# Altium project NFC-Reader.PrjPcb (part 9 of 11)
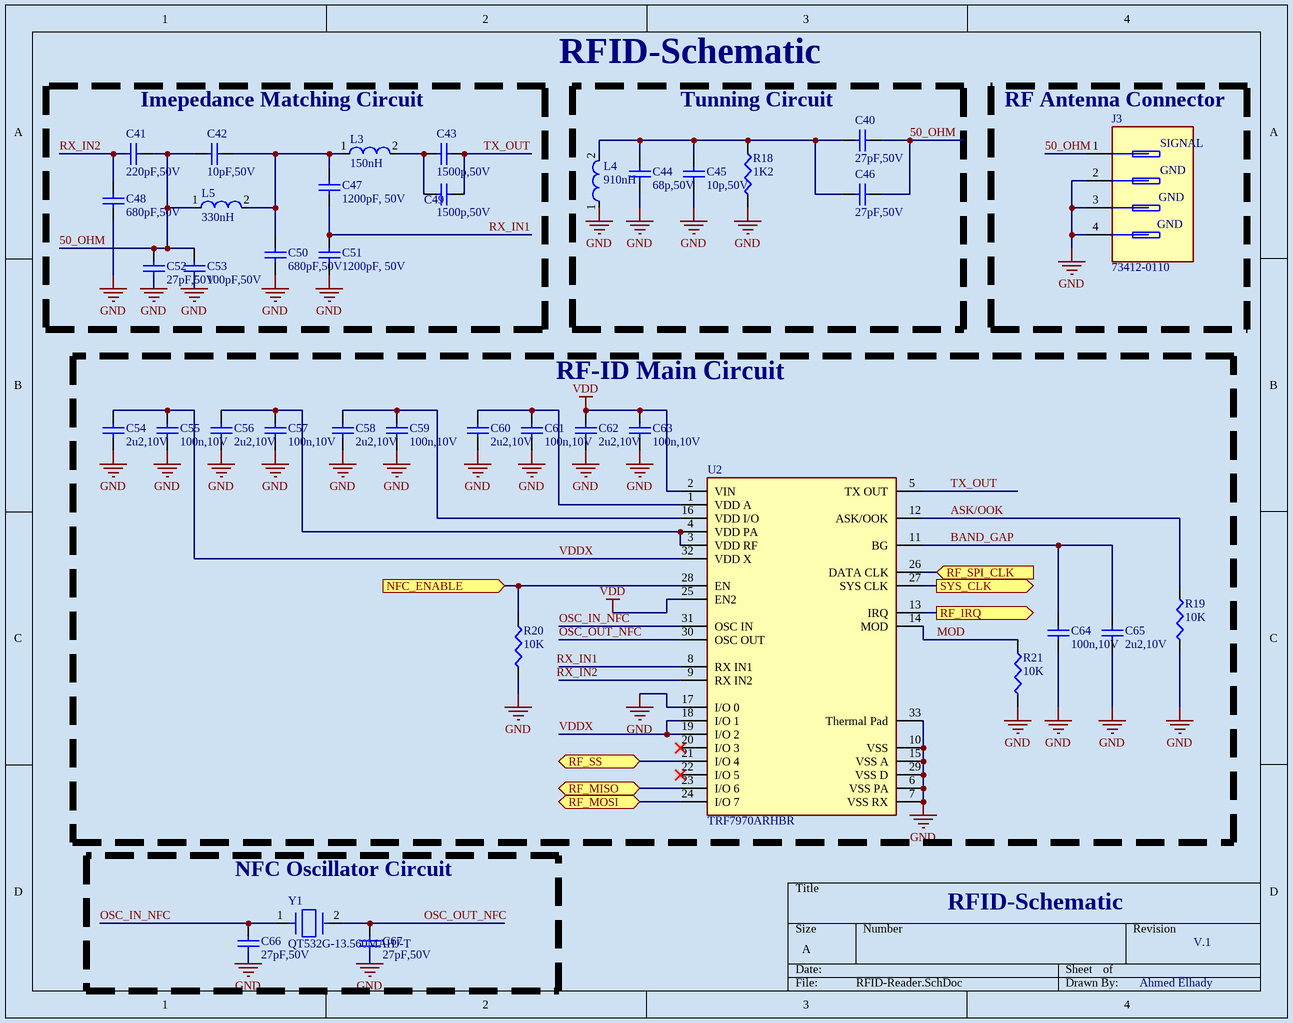
[diagram p12: RFID-Reader.SchDoc]

## Sheet RFID-Reader.SchDoc (continued)

### Library data of the parts (continued)
C53 = GRM1555C1H101JA01D: 100 pF ±5% 50V Ceramic Capacitor C0G, NP0 0402 (1005 Metric); Manufacturer: Murata; Manufacturer Lifecycle Status: NRND; Supplier: DigiKey; Manufacturer Part Number: GRM1555C1H101JA01D; RoHS: Compliant; Category: Ceramic Capacitors; Stock: 456624; Pricing: 1=0.1, 10=0.022, 50=0.0144, 100=0.0122, 500=0.0085, 1000=0.00738, 2500=0.0062, 5000=0.0055 (USD); Value: 100pF; Case/Package: 0402; Case Code (Imperial): 0402; Case Code (Metric): 1005; Depth: 500µm; Dielectric: C0G; Dielectric Material: Ceramic; Height: 500µm; Lead Free: Lead Free; Length: 1mm; Lifecycle Status: NRND; Material: Ceramic; Max Operating Temperature: 125°C; Min Operating Temperature: -55°C; Mounting Technology: Surface Mount; Number of Terminals: 2; Packaging: Cut Tape; Radiation Hardening: No; REACH SVHC: Yes; Schedule B: 8532240020, 8532240020|8532240020, 8532240020|8532240020|8532240020, 8532240020|8532240020|8532240020|8532240020; Termination: SMD/SMT; Thickness: 500µm; Tolerance: 5%; Voltage: 50V; Voltage Rating: 50V; Voltage Rating (DC): 50V; Width: 500µm; ComponentLink1URL: https://datasheet.octopart.com:443/GRM1555C1H101JA01D-Murata-datasheet-12559435.pdf?src-supplier=element14+APAC; ComponentLink1Description: https://datasheet.octopart.com:443/GRM1555C1H101JA01D-Murata-datasheet-12559435.pdf?src-supplier=element14+APAC; ComponentLink2URL: https://datasheet.octopart.com:443/GRM1555C1H101JA01D-Murata-datasheet-62317043.pdf?src-supplier=element14+APAC; ComponentLink2Description: https://datasheet.octopart.com:443/GRM1555C1H101JA01D-Murata-datasheet-62317043.pdf?src-supplier=element14+APAC; ComponentLink3URL: https://datasheet.octopart.com:443/GRM1555C1H101JA01D-Murata-datasheet-11894428.pdf?src-supplier=_legacy+Avnet; ComponentLink3Description: https://datasheet.octopart.com:443/GRM1555C1H101JA01D-Murata-datasheet-11894428.pdf?src-supplier=_legacy+Avnet; ComponentLink4URL: https://datasheet.octopart.com:443/GRM1555C1H101JA01D-Murata-datasheet-14396361.pdf?src-supplier=Future+Electronics; ComponentLink4Description: https://datasheet.octopart.com:443/GRM1555C1H101JA01D-Murata-datasheet-14396361.pdf?src-supplier=Future+Electronics; ComponentLink5URL: https://datasheet.octopart.com:443/GRM1555C1H101JA01D-Murata-datasheet-22122223.pdf?src-supplier=Future+Electronics; ComponentLink5Description: https://datasheet.octopart.com:443/GRM1555C1H101JA01D-Murata-datasheet-22122223.pdf?src-supplier=Future+Electronics; ComponentLink6URL: https://datasheet.octopart.com:443/GRM1555C1H101JA01D-Murata-datasheet-44105804.pdf?src-supplier=Future+Electronics; ComponentLink6Description: https://datasheet.octopart.com:443/GRM1555C1H101JA01D-Murata-datasheet-44105804.pdf?src-supplier=Future+Electronics; ComponentLink7URL: https://datasheet.octopart.com:443/GRM1555C1H101JA01D-Murata-datasheet-165579666.pdf?src-supplier=TME; ComponentLink7Description: https://datasheet.octopart.com:443/GRM1555C1H101JA01D-Murata-datasheet-165579666.pdf?src-supplier=TME; ComponentLink8URL: https://datasheet.octopart.com:443/GRM1555C1H101JA01D-Murata-datasheet-59876780.pdf?src-supplier=TME; ComponentLink8Description: https://datasheet.octopart.com:443/GRM1555C1H101JA01D-Murata-datasheet-59876780.pdf?src-supplier=TME; ComponentLink9URL: https://datasheet.octopart.com:443/GRM1555C1H101JA01D-Murata-datasheet-141266224.pdf?src-supplier=Ciiva; ComponentLink9Description: https://datasheet.octopart.com:443/GRM1555C1H101JA01D-Murata-datasheet-141266224.pdf?src-supplier=Ciiva; ComponentLink10URL: https://datasheet.octopart.com:443/GRM1555C1H101JA01D-Murata-datasheet-140680898.pdf?src-supplier=Ciiva; ComponentLink10Description: https://datasheet.octopart.com:443/GRM1555C1H101JA01D-Murata-datasheet-140680898.pdf?src-supplier=Ciiva; ComponentLink11URL: https://datasheet.octopart.com:443/GRM1555C1H101JA01D-Murata-datasheet-138739442.pdf?src-supplier=Ciiva; ComponentLink11Description: https://datasheet.octopart.com:443/GRM1555C1H101JA01D-Murata-datasheet-138739442.pdf?src-supplier=Ciiva; ComponentLink12URL: https://datasheet.octopart.com/GRM1555C1H101JA01D-Murata-datasheet-12515295.pdf; ComponentLink12Description: https://datasheet.octopart.com/GRM1555C1H101JA01D-Murata-datasheet-12515295.pdf; ComponentLink13URL: https://datasheet.octopart.com/GRM1555C1H101JA01D-Murata-datasheet-12510076.pdf; ComponentLink13Description: https://datasheet.octopart.com/GRM1555C1H101JA01D-Murata-datasheet-12510076.pdf; ComponentLink14URL: https://datasheet.octopart.com/GRM1555C1H101JA01D-Murata-datasheet-11978611.pdf; ComponentLink14Description: https://datasheet.octopart.com/GRM1555C1H101JA01D-Murata-datasheet-11978611.pdf; ComponentLink15URL: https://datasheet.octopart.com/GRM1555C1H101JA01D-Murata-datasheet-10025737.pdf; ComponentLink15Description: https://datasheet.octopart.com/GRM1555C1H101JA01D-Murata-datasheet-10025737.pdf; ComponentLink16URL: https://datasheet.octopart.com/GRM1555C1H101JA01D-Murata-datasheet-8819587.pdf; ComponentLink16Description: https://datasheet.octopart.com/GRM1555C1H101JA01D-Murata-datasheet-8819587.pdf; ComponentLink17URL: http://sigma.octopart.com:80/reach_statement/Murata-company-16.pdf?src-supplier=Compliance+Statements; ComponentLink17Description: http://sigma.octopart.com:80/reach_statement/Murata-company-16.pdf?src-supplier=Compliance+Statements; LCSC PN: C77177
C54 C56 C58 C60 C62 C65 = GRM155Z71A225KE44D: 2.2 µF ±10% 10V Ceramic Capacitor X7R 0402 (1005 Metric); Manufacturer: Murata; Manufacturer Lifecycle Status: IN PRODUCTION; Value: 2.2µF; Supplier: DigiKey; Manufacturer Part Number: GRM155Z71A225KE44D; RoHS: Compliant; Category: Ceramic Capacitors; Stock: 150874; Pricing: 1=0.15, 10=0.083, 50=0.0582, 100=0.0506, 500=0.0359, 1000=0.03409, 2500=0.02999 (USD); Case/Package: 0402; Dielectric Material: Ceramic; Height: 500µm; Length: 1mm; Lifecycle Status: Production; Material: Ceramic; Max Operating Temperature: 125°C; Min Operating Temperature: -55°C; Mounting Technology: Surface Mount; Pins: 2; Number of Terminals: 2; REACH SVHC: Yes; Thickness: 500µm; Tolerance: 10%; Voltage Rating: 10V; Voltage Rating (DC): 10V; Width: 500µm; ComponentLink1URL: https://datasheet.octopart.com:443/GRM155Z71A225KE44D-Murata-datasheet-165579666.pdf?src-supplier=TME; ComponentLink1Description: https://datasheet.octopart.com:443/GRM155Z71A225KE44D-Murata-datasheet-165579666.pdf?src-supplier=TME; ComponentLink2URL: https://datasheet.octopart.com:443/GRM155Z71A225KE44D-Murata-datasheet-141266224.pdf?src-supplier=Ciiva; ComponentLink2Description: https://datasheet.octopart.com:443/GRM155Z71A225KE44D-Murata-datasheet-141266224.pdf?src-supplier=Ciiva; ComponentLink3URL: https://datasheet.octopart.com:443/GRM155Z71A225KE44D-Murata-datasheet-140692717.pdf?src-supplier=Ciiva; ComponentLink3Description: https://datasheet.octopart.com:443/GRM155Z71A225KE44D-Murata-datasheet-140692717.pdf?src-supplier=Ciiva; ComponentLink4URL: https://datasheet.octopart.com:443/GRM155Z71A225KE44D-Murata-datasheet-138741105.pdf?src-supplier=Ciiva; ComponentLink4Description: https://datasheet.octopart.com:443/GRM155Z71A225KE44D-Murata-datasheet-138741105.pdf?src-supplier=Ciiva; ComponentLink5URL: http://sigma.octopart.com:80/reach_statement/Murata-company-16.pdf?src-supplier=Compliance+Statements; ComponentLink5Description: http://sigma.octopart.com:80/reach_statement/Murata-company-16.pdf?src-supplier=Compliance+Statements; LCSC PN: C2999759
C55 C57 C59 C61 C63 C64 = CL05B104KP5NNNC: 0.1 µF ±10% 10V Ceramic Capacitor X7R 0402 (1005 Metric); Manufacturer: Samsung Electro-Mechanics; Value: 100nF; Supplier: DigiKey; Manufacturer Part Number: CL05B104KP5NNNC; RoHS: Compliant; Category: Ceramic Capacitors; Stock: 28864890; Pricing: 1=0.1, 10=0.023, 50=0.0152, 100=0.0129, 500=0.00904, 1000=0.00787, 2500=0.00663, 5000=0.00589 (USD); Case/Package: 0402; Case Code (Imperial): 0402; Case Code (Metric): 1005; China RoHS: Compliant; Contact Plating: Tin; Depth: 500µm; Dielectric: X7R; Dielectric Material: Ceramic; Height: 500µm; Length: 1mm; Lifecycle Status: Production; Material: Ceramic; Max Operating Temperature: 125°C; Min Operating Temperature: -55°C; Mounting Technology: Surface Mount; Number of Terminals: 2; Radiation Hardening: No; REACH SVHC: Yes; Schedule B: 8532240020, 8532240020|8532240020, 8532240020|8532240020|8532240020, 8532240020|8532240020|8532240020|8532240020; Thickness: 558.8µm; Tolerance: 10%; Voltage Rating: 10V; Voltage Rating (DC): 10V; Width: 500µm; ComponentLink1URL: https://datasheet.octopart.com:443/CL05B104KP5NNNC-Samsung-Electro-Mechanics-datasheet-182018737.pdf?src-supplier=IHS; ComponentLink1Description: https://datasheet.octopart.com:443/CL05B104KP5NNNC-Samsung-Electro-Mechanics-datasheet-182018737.pdf?src-supplier=IHS; ComponentLink2URL: https://datasheet.octopart.com/CL05B104KP5NNNC-Samsung-Electro-Mechanics-datasheet-8324245.pdf; ComponentLink2Description: https://datasheet.octopart.com/CL05B104KP5NNNC-Samsung-Electro-Mechanics-datasheet-8324245.pdf; ComponentLink3URL: https://datasheet.octopart.com/CL05B104KP5NNNC-Samsung-Electro-Mechanics-datasheet-97040617.pdf; ComponentLink3Description: https://datasheet.octopart.com/CL05B104KP5NNNC-Samsung-Electro-Mechanics-datasheet-97040617.pdf; ComponentLink4URL: https://datasheet.octopart.com/General-Multilayer-Ceramic-Capacitors-Samsung-datasheet-family-111.pdf; ComponentLink4Description: https://datasheet.octopart.com/General-Multilayer-Ceramic-Capacitors-Samsung-datasheet-family-111.pdf; ComponentLink5URL: https://datasheet.octopart.com:443/CL05B104KP5NNNC-Samsung-Electro-Mechanics-datasheet-141346865.pdf?src-supplier=Samsung+SCT; ComponentLink5Description: https://datasheet.octopart.com:443/CL05B104KP5NNNC-Samsung-Electro-Mechanics-datasheet-141346865.pdf?src-supplier=Samsung+SCT; ComponentLink6URL: https://datasheet.octopart.com:443/CL05B104KP5NNNC-Samsung-Electro-Mechanics-datasheet-116890912.pdf?src-supplier=Future+Electronics; ComponentLink6Description: https://datasheet.octopart.com:443/CL05B104KP5NNNC-Samsung-Electro-Mechanics-datasheet-116890912.pdf?src-supplier=Future+Electronics; ComponentLink7URL: https://datasheet.octopart.com:443/CL05B104KP5NNNC-Samsung-Electro-Mechanics-datasheet-81461625.pdf?src-supplier=Future+Electronics; ComponentLink7Description: https://datasheet.octopart.com:443/CL05B104KP5NNNC-Samsung-Electro-Mechanics-datasheet-81461625.pdf?src-supplier=Future+Electronics; ComponentLink8URL: https://datasheet.octopart.com:443/CL05B104KP5NNNC-Samsung-datasheet-42485124.pdf?src-supplier=Future+Electronics; ComponentLink8Description: https://datasheet.octopart.com:443/CL05B104KP5NNNC-Samsung-datasheet-42485124.pdf?src-supplier=Future+Electronics; ComponentLink9URL: https://datasheet.octopart.com:443/CL05B104KP5NNNC-Samsung-datasheet-26589026.pdf?src-supplier=Future+Electronics; ComponentLink9Description: https://datasheet.octopart.com:443/CL05B104KP5NNNC-Samsung-datasheet-26589026.pdf?src-supplier=Future+Electronics; ComponentLink10URL: https://datasheet.octopart.com:443/CL05B104KP5NNNC-Samsung-Electro-Mechanics-datasheet-149136717.pdf?src-supplier=Future+Electronics; ComponentLink10Description: https://datasheet.octopart.com:443/CL05B104KP5NNNC-Samsung-Electro-Mechanics-datasheet-149136717.pdf?src-supplier=Future+Electronics; ComponentLink11URL: https://datasheet.octopart.com:443/CL05B104KP5NNNC-Samsung-Electro-Mechanics-datasheet-17925223.pdf?src-supplier=iiiC; ComponentLink11Description: https://datasheet.octopart.com:443/CL05B104KP5NNNC-Samsung-Electro-Mechanics-datasheet-17925223.pdf?src-supplier=iiiC; ComponentLink12URL: https://datasheet.octopart.com:443/CL05B104KP5NNNC-Samsung-datasheet-8326407.pdf?src-supplier=TME; ComponentLink12Description: https://datasheet.octopart.com:443/CL05B104KP5NNNC-Samsung-datasheet-8326407.pdf?src-supplier=TME; ComponentLink13URL: http://sigma.octopart.com:80/rohs_certificate/General-Multilayer-Ceramic-Capacitors-Samsung-family-110.pdf?src-supplier=Compliance+Statements; ComponentLink13Description: http://sigma.octopart.com:80/rohs_certificate/General-Multilayer-Ceramic-Capacitors-Samsung-family-110.pdf?src-supplier=Compliance+Statements; ComponentLink14URL: http://sigma.octopart.com:80/rohs_statement/General-Multilayer-Ceramic-Capacitors-Samsung-family-132.pdf?src-supplier=Compliance+Statements; ComponentLink14Description: http://sigma.octopart.com:80/rohs_statement/General-Multilayer-Ceramic-Capacitors-Samsung-family-132.pdf?src-supplier=Compliance+Statements; ComponentLink15URL: http://sigma.octopart.com:80/reach_statement/General-Multilayer-Ceramic-Capacitors-Samsung-family-133.pdf?src-supplier=Compliance+Statements; ComponentLink15Description: http://sigma.octopart.com:80/reach_statement/General-Multilayer-Ceramic-Capacitors-Samsung-family-133.pdf?src-supplier=Compliance+Statements; LCSC PN: C133086
J3 = 73412-0110: U.FL (UMCC) ANTENNA Connector Receptacle, Male Pin 50 Ohms Surface Mount Solder; Manufacturer: Molex; Manufacturer Lifecycle Status: ACTIVE; Body Material: Liquid Crystal Polymer, Polymer; Body Plating: Gold; Connector Type: Coaxial; Contact Resistance: 25mΩ; Dielectric Material: Liquid Crystal Polymer; Frequency: 6GHz; Gender: Female; Impedance: 50Ω; Insulation Resistance: 100MΩ; Number of Ports: 1; Polarity: Standard; Voltage Rating: 60V; Supplier: DigiKey; Manufacturer Part Number: 73412-0110; RoHS: Compliant; Category: RF / Coaxial Connectors; Stock: 130802; Pricing: 1=0.8, 10=0.675, 25=0.6328, 50=0.6028, 100=0.5739, 250=0.53788, 500=0.5122, 1000=0.48774, 2500=0.4572, 5000=0.42867, 10000=0.40822, 15000=0.39672, 25000=0.38269 (USD); China RoHS: Compliant; Contact Gender: Female; Contact Material: Brass; Contact Plating: Gold; Country of Origin: US; Halogen Free: Low Halogen; Height: 1.25mm; Lead Free: Lead Free; Length: 3mm; Lifecycle Status: Production; Material: Bronze; Clock Frequency: 6GHz; Max Operating Temperature: 90°C; Min Operating Temperature: -40°C; Mounting Technology: Surface Mount; Pins: 1; Orientation: Straight; Packaging: Tape and Reel; Radiation Hardening: No; REACH SVHC: Yes; Termination: Solder; Voltage Rating (AC): 60V; Width: 3mm; ComponentLink1URL: https://datasheet.octopart.com:443/73412-0110-Molex-datasheet-180780342.pdf?src-supplier=IHS; ComponentLink1Description: https://datasheet.octopart.com:443/73412-0110-Molex-datasheet-180780342.pdf?src-supplier=IHS; ComponentLink2URL: https://datasheet.octopart.com:443/73412-0110-Molex-datasheet-13797444.pdf?src-supplier=Molex; ComponentLink2Description: https://datasheet.octopart.com:443/73412-0110-Molex-datasheet-13797444.pdf?src-supplier=Molex; ComponentLink3URL: https://datasheet.octopart.com:443/73412-0110-Molex-datasheet-12565081.pdf?src-supplier=Upverter; ComponentLink3Description: https://datasheet.octopart.com:443/73412-0110-Molex-datasheet-12565081.pdf?src-supplier=Upverter; ComponentLink4URL: https://datasheet.octopart.com:443/73412-0110-Molex-datasheet-8545995.pdf?src-supplier=Upverter; ComponentLink4Description: https://datasheet.octopart.com:443/73412-0110-Molex-datasheet-8545995.pdf?src-supplier=Upverter; ComponentLink5URL: https://datasheet.octopart.com:443/73412-0110-Molex-datasheet-154758340.pdf?src-supplier=Master+Electronics; ComponentLink5Description: https://datasheet.octopart.com:443/73412-0110-Molex-datasheet-154758340.pdf?src-supplier=Master+Electronics; ComponentLink6URL: https://datasheet.octopart.com:443/73412-0110-Molex-datasheet-101583680.pdf?src-supplier=Farnell; ComponentLink6Description: https://datasheet.octopart.com:443/73412-0110-Molex-datasheet-101583680.pdf?src-supplier=Farnell; ComponentLink7URL: https://datasheet.octopart.com:443/73412-0110-Molex-datasheet-11536961.pdf?src-supplier=Farnell; ComponentLink7Description: https://datasheet.octopart.com:443/73412-0110-Molex-datasheet-11536961.pdf?src-supplier=Farnell; ComponentLink8URL: https://datasheet.octopart.com:443/73412-0110-Molex-datasheet-11046821.pdf?src-supplier=Farnell; ComponentLink8Description: https://datasheet.octopart.com:443/73412-0110-Molex-datasheet-11046821.pdf?src-supplier=Farnell; ComponentLink9URL: https://datasheet.octopart.com:443/73412-0110-Molex-datasheet-540048.pdf?src-supplier=Farnell; ComponentLink9Description: https://datasheet.octopart.com:443/73412-0110-Molex-datasheet-540048.pdf?src-supplier=Farnell; ComponentLink10URL: https://datasheet.octopart.com:443/73412-0110-Molex-datasheet-27085815.pdf?src-supplier=Electro+Sonic; ComponentLink10Description: https://datasheet.octopart.com:443/73412-0110-Molex-datasheet-27085815.pdf?src-supplier=Electro+Sonic; ComponentLink11URL: https://datasheet.octopart.com:443/73412-0110-Molex-datasheet-44403139.pdf?src-supplier=Electro+Sonic; ComponentLink11Description: https://datasheet.octopart.com:443/73412-0110-Molex-datasheet-44403139.pdf?src-supplier=Electro+Sonic; ComponentLink12URL: https://datasheet.octopart.com:443/73412-0110-Molex-datasheet-188909867.pdf?src-supplier=TME; ComponentLink12Description: https://datasheet.octopart.com:443/73412-0110-Molex-datasheet-188909867.pdf?src-supplier=TME; ComponentLink13URL: https://datasheet.octopart.com:443/73412-0110-Molex-datasheet-45012700.pdf?src-supplier=TME; ComponentLink13Description: https://datasheet.octopart.com:443/73412-0110-Molex-datasheet-45012700.pdf?src-supplier=TME; ComponentLink14URL: https://datasheet.octopart.com:443/73412-0110-Molex-datasheet-140187864.pdf?src-supplier=RS+(Formerly+Allied+Electronics); ComponentLink14Description: https://datasheet.octopart.com:443/73412-0110-Molex-datasheet-140187864.pdf?src-supplier=RS+(Formerly+Allied+Electronics); ComponentLink15URL: https://datasheet.octopart.com:443/73412-0110-Molex-datasheet-120156196.pdf?src-supplier=RS+(Formerly+Allied+Electronics); ComponentLink15Description: https://datasheet.octopart.com:443/73412-0110-Molex-datasheet-120156196.pdf?src-supplier=RS+(Formerly+Allied+Electronics); ComponentLink16URL: https://datasheet.octopart.com:443/73412-0110-Molex-datasheet-34442373.pdf?src-supplier=RS+(Formerly+Allied+Electronics); ComponentLink16Description: https://datasheet.octopart.com:443/73412-0110-Molex-datasheet-34442373.pdf?src-supplier=RS+(Formerly+Allied+Electronics); ComponentLink17URL: https://datasheet.octopart.com:443/734120110-Molex-datasheet-137316104.pdf?src-supplier=Future+Electronics; ComponentLink17Description: https://datasheet.octopart.com:443/734120110-Molex-datasheet-137316104.pdf?src-supplier=Future+Electronics; ComponentLink18URL: https://datasheet.octopart.com:443/73412-0110-Molex-datasheet-33004214.pdf?src-supplier=Newark; ComponentLink18Description: https://datasheet.octopart.com:443/73412-0110-Molex-datasheet-33004214.pdf?src-supplier=Newark; ComponentLink19URL: https://datasheet.octopart.com:443/73412-0110-Molex-datasheet-33004213.pdf?src-supplier=Newark; ComponentLink19Description: https://datasheet.octopart.com:443/73412-0110-Molex-datasheet-33004213.pdf?src-supplier=Newark; ComponentLink20URL: http://sigma.octopart.com:80/16441449/rohs_statement/Molex-734120110.pdf?src-supplier=Compliance+Statements; ComponentLink20Description: http://sigma.octopart.com:80/16441449/rohs_statement/Molex-734120110.pdf?src-supplier=Compliance+Statements; ComponentLink21URL: http://sigma.octopart.com:80/conflict_mineral_statement/Molex-company-72.pdf?src-supplier=Compliance+Statements; ComponentLink21Description: http://sigma.octopart.com:80/conflict_mineral_statement/Molex-company-72.pdf?src-supplier=Compliance+Statements; ComponentLink22URL: http://sigma.octopart.com:80/rohs_statement/Molex-company-73.pdf?src-supplier=Compliance+Statements; ComponentLink22Description: http://sigma.octopart.com:80/rohs_statement/Molex-company-73.pdf?src-supplier=Compliance+Statements; ComponentLink23URL: http://sigma.octopart.com:80/reach_statement/Molex-company-74.pdf?src-supplier=Compliance+Statements; ComponentLink23Description: http://sigma.octopart.com:80/reach_statement/Molex-company-74.pdf?src-supplier=Compliance+Statements; LCSC PN: C434806
L3 = 744762215A: 150 nH Unshielded Drum Core, Wirewound Inductor 800 mA 220mOhm Max 1008 (2520 Metric); Manufacturer: Wurth Elektronik; Core Material: Ceramic; Current Rating: 800mA; DC Resistance (DCR): 220mΩ; Frequency: 100MHz; Inductance Tolerance: 5%; Q Factor: 45; Self Resonant Frequency: 880MHz; Supplier: DigiKey; Manufacturer Part Number: 744762215A; RoHS: Compliant; Category: Fixed Inductors; Stock: 3153; Pricing: 1=0.47, 10=0.45, 50=0.419, 100=0.388, 500=0.357, 1000=0.327, 2000=0.2664 (USD); Ambient Temperature Range High: 110°C; Ambient Temperature Range Low: -40°C; Case/Package: 1008; Case Code (Imperial): 1008; Case Code (Metric): 2520; Composition: Ceramic, Wirewound; Height: 1.6mm; Value: 150nH; Length: 2.5mm; Material: Ceramic; Max DC Current: 800mA; Max Operating Temperature: 125°C; Min Operating Temperature: -40°C; Mounting Technology: Surface Mount; REACH SVHC: Unknown; ESR: 220mΩ; Shielding: Unshielded; Termination: SMD/SMT; Test Frequency: 100MHz; Tolerance: 5%; Weight: 20mg; Width: 2mm; ComponentLink1URL: https://datasheet.octopart.com:443/744762215A-Wurth-Elektronik-datasheet-168491789.pdf?src-supplier=Wurth+Elektronik; ComponentLink1Description: https://datasheet.octopart.com:443/744762215A-Wurth-Elektronik-datasheet-168491789.pdf?src-supplier=Wurth+Elektronik; ComponentLink2URL: https://datasheet.octopart.com:443/744762215A-W%C3%BCrth-Elektronik-datasheet-11520320.pdf?src-supplier=element14+APAC; ComponentLink2Description: https://datasheet.octopart.com:443/744762215A-W%C3%BCrth-Elektronik-datasheet-11520320.pdf?src-supplier=element14+APAC; ComponentLink3URL: https://datasheet.octopart.com:443/744762215A-Wurth-Elektronik-datasheet-181536004.pdf?src-supplier=Newark; ComponentLink3Description: https://datasheet.octopart.com:443/744762215A-Wurth-Elektronik-datasheet-181536004.pdf?src-supplier=Newark
L4 = BWCS00292821R91J00: 910 nH Unshielded Drum Core, Wirewound Inductor 380 mA 1.68Ohm Max 1008 (2520 Metric); Manufacturer: Pulse Electronics; Core Material: Ceramic; DC Resistance (DCR): 1.68Ω; Max Current Rating: 380mA; Number of Circuits: 1; Q Factor: 35; Self Resonant Frequency: 320MHz; Shielding: No; Test Frequency: 25MHz; Tolerance: 5%; Supplier: DigiKey; Manufacturer Part Number: BWCS00292821R91J00; RoHS: Compliant; Category: Fixed Inductors; Pricing: 2000=0.08178 (USD); Case/Package: 1008; Height: 2.1mm; Value: 910nH; Lifecycle Status: Production; Max Operating Temperature: 125°C; Min Operating Temperature: -40°C; Number of Terminals: 2; REACH SVHC: Yes; Width: 2.79mm; ComponentLink1URL: https://datasheet.octopart.com:443/BWCS00292821R91J00-Pulse-datasheet-180094650.pdf?src-supplier=IHS; ComponentLink1Description: https://datasheet.octopart.com:443/BWCS00292821R91J00-Pulse-datasheet-180094650.pdf?src-supplier=IHS; ComponentLink2URL: https://datasheet.octopart.com:443/BWCS00292821R91J00-Pulse-datasheet-155427417.pdf?src-supplier=IHS; ComponentLink2Description: https://datasheet.octopart.com:443/BWCS00292821R91J00-Pulse-datasheet-155427417.pdf?src-supplier=IHS; LCSC PN: C5564290
L5 = 744762233A: 330 nH Unshielded Drum Core, Wirewound Inductor 500 mA 900mOhm Max 1008 (2520 Metric); Manufacturer: Wurth Elektronik; Core Material: Ceramic; Current Rating: 500mA; DC Resistance (DCR): 900mΩ; Frequency: 100MHz; Inductance Tolerance: 5%; Q Factor: 45; Self Resonant Frequency: 570MHz; Supplier: DigiKey; Manufacturer Part Number: 744762233A; RoHS: Compliant; Category: Fixed Inductors; Stock: 5048; Pricing: 1=0.47, 10=0.45, 50=0.419, 100=0.388, 500=0.357, 1000=0.327, 2000=0.2664 (USD); Ambient Temperature Range High: 110°C; Ambient Temperature Range Low: -40°C; Case/Package: 1008; Case Code (Imperial): 1008; Case Code (Metric): 2520; Composition: Ceramic, Wirewound; Height: 1.6mm; Value: 330nH; Length: 2.5mm; Material: Ceramic; Max DC Current: 500mA; Max Operating Temperature: 125°C; Min Operating Temperature: -40°C; Mounting Technology: Surface Mount; REACH SVHC: Unknown; ESR: 900mΩ; Shielding: Unshielded; Termination: SMD/SMT; Test Frequency: 100MHz; Tolerance: 5%; Weight: 20mg; Width: 2mm; ComponentLink1URL: https://datasheet.octopart.com:443/744762233A-Wurth-Elektronik-datasheet-168491793.pdf?src-supplier=Farnell; ComponentLink1Description: https://datasheet.octopart.com:443/744762233A-Wurth-Elektronik-datasheet-168491793.pdf?src-supplier=Farnell; ComponentLink2URL: https://datasheet.octopart.com:443/744762233A-W%C3%BCrth-Elektronik-datasheet-11534833.pdf?src-supplier=element14+APAC; ComponentLink2Description: https://datasheet.octopart.com:443/744762233A-W%C3%BCrth-Elektronik-datasheet-11534833.pdf?src-supplier=element14+APAC; ComponentLink3URL: https://datasheet.octopart.com:443/744762233A-Wurth-Elektronik-datasheet-181536009.pdf?src-supplier=Newark; ComponentLink3Description: https://datasheet.octopart.com:443/744762233A-Wurth-Elektronik-datasheet-181536009.pdf?src-supplier=Newark; ComponentLink4URL: https://datasheet.octopart.com:443/744762233A-W%C3%BCrth-Elektronik-datasheet-111089033.pdf?src-supplier=RS+(Formerly+Allied+Electronics); ComponentLink4Description: https://datasheet.octopart.com:443/744762233A-W%C3%BCrth-Elektronik-datasheet-111089033.pdf?src-supplier=RS+(Formerly+Allied+Electronics)
R18 = RC0402JR-071K2L: 1.2 kOhms ±5% 0.063W, 1/16W Chip Resistor 0402 (1005 Metric) Moisture Resistant Thick Film; Manufacturer: Yageo Group; Power Dissipation: 62.5mW; Value: 1.2kΩ; Temperature Coefficient: 100ppm/°C; Voltage Rating: 50V; Supplier: DigiKey; Manufacturer Part Number: RC0402JR-071K2L; RoHS: Compliant; Category: Chip SMD Resistors; Stock: 1187912; Pricing: 1=0.1, 10=0.007, 25=0.006, 50=0.0052, 100=0.0046, 250=0.00416, 500=0.00284 (USD); Case/Package: 0402; Case Code (Imperial): 0402; China RoHS: Non-Compliant; Composition: Thick Film; Depth: 500µm; Height: 350µm; Lead Free: Lead Free; Length: 1mm; Lifecycle Status: Production; Max Operating Temperature: 155°C; Military Standard: Not; Min Operating Temperature: -55°C; Mounting Technology: Surface Mount; Pins: 2; Number of Terminals: 2; Packaging: Cut Tape; Power Rating: 62.5mW; REACH SVHC: Yes; Schedule B: 8533210045, 8533210045|8533210045|8533210045|8533210045|8533210045; Termination: SMD/SMT; Tolerance: 5%; Voltage Rating (AC): 50V; Voltage Rating (DC): 50V; Width: 500µm; Working Voltage: 50V; ComponentLink1URL: https://datasheet.octopart.com:443/RC0402JR-071K2L-Yageo-datasheet-175887523.pdf?src-supplier=IHS; ComponentLink1Description: https://datasheet.octopart.com:443/RC0402JR-071K2L-Yageo-datasheet-175887523.pdf?src-supplier=IHS; ComponentLink2URL: https://datasheet.octopart.com:443/RC0402JR-071K2L-Yageo-datasheet-10408619.pdf?src-supplier=Newark; ComponentLink2Description: https://datasheet.octopart.com:443/RC0402JR-071K2L-Yageo-datasheet-10408619.pdf?src-supplier=Newark; ComponentLink3URL: https://datasheet.octopart.com:443/RC0402JR-071K2L-Yageo-datasheet-8324527.pdf?src-supplier=Newark; ComponentLink3Description: https://datasheet.octopart.com:443/RC0402JR-071K2L-Yageo-datasheet-8324527.pdf?src-supplier=Newark; ComponentLink4URL: https://datasheet.octopart.com:443/RC0402JR-071K2L-Yageo-datasheet-62067350.pdf?src-supplier=element14+APAC; ComponentLink4Description: https://datasheet.octopart.com:443/RC0402JR-071K2L-Yageo-datasheet-62067350.pdf?src-supplier=element14+APAC; ComponentLink5URL: https://datasheet.octopart.com:443/RC0402JR-071K2L-Yageo-datasheet-164759695.pdf?src-supplier=Future+Electronics; ComponentLink5Description: https://datasheet.octopart.com:443/RC0402JR-071K2L-Yageo-datasheet-164759695.pdf?src-supplier=Future+Electronics; ComponentLink6URL: https://datasheet.octopart.com:443/RC0402JR-071K2L-Yageo-datasheet-137700087.pdf?src-supplier=Future+Electronics; ComponentLink6Description: https://datasheet.octopart.com:443/RC0402JR-071K2L-Yageo-datasheet-137700087.pdf?src-supplier=Future+Electronics; ComponentLink7URL: https://datasheet.octopart.com:443/RC0402JR-071K2L-Yageo-datasheet-12531192.pdf?src-supplier=Future+Electronics; ComponentLink7Description: https://datasheet.octopart.com:443/RC0402JR-071K2L-Yageo-datasheet-12531192.pdf?src-supplier=Future+Electronics; ComponentLink8URL: https://datasheet.octopart.com:443/RC0402JR-071K2L-Yageo-datasheet-505231.pdf?src-supplier=Future+Electronics; ComponentLink8Description: https://datasheet.octopart.com:443/RC0402JR-071K2L-Yageo-datasheet-505231.pdf?src-supplier=Future+Electronics; ComponentLink9URL: https://datasheet.octopart.com/RC0402JR-071K2L-Yageo-datasheet-73766026.pdf; ComponentLink9Description: https://datasheet.octopart.com/RC0402JR-071K2L-Yageo-datasheet-73766026.pdf; ComponentLink10URL: https://datasheet.octopart.com:443/RC0402JR-071K2L-Yageo-datasheet-8329306.pdf?src-supplier=element14; ComponentLink10Description: https://datasheet.octopart.com:443/RC0402JR-071K2L-Yageo-datasheet-8329306.pdf?src-supplier=element14; ComponentLink11URL: http://sigma.octopart.com:80/conflict_mineral_statement/Yageo-company-3.pdf?src-supplier=Compliance+Statements; ComponentLink11Description: http://sigma.octopart.com:80/conflict_mineral_statement/Yageo-company-3.pdf?src-supplier=Compliance+Statements; ComponentLink12URL: http://sigma.octopart.com:80/rohs_statement/Yageo-company-2.pdf?src-supplier=Compliance+Statements; ComponentLink12Description: http://sigma.octopart.com:80/rohs_statement/Yageo-company-2.pdf?src-supplier=Compliance+Statements; LCSC PN: C137910
R19-R21 = RC0603FR-0710KL: 10 kOhms ±1% 0.1W, 1/10W Chip Resistor 0603 (1608 Metric) Moisture Resistant Thick Film; Manufacturer: Yageo Group; Power Dissipation: 100mW; Value: 10kΩ; Temperature Coefficient: 100ppm/°C; Voltage Rating: 75V; Voltage Rating (DC): 50V; Supplier: DigiKey; Manufacturer Part Number: RC0603FR-0710KL; RoHS: Compliant; Category: Chip SMD Resistors; Stock: 14914136; Pricing: 1=0.1, 10=0.006, 25=0.0052 (USD); Case/Package: 0603; Case Code (Imperial): 0603; Case Code (Metric): 0603; China RoHS: Non-Compliant; Composition: Thick Film; Depth: 800µm; Height: 450µm; Lead Free: Lead Free; Lead Pitch: 300µm; Length: 1.6mm; Lifecycle Status: Production; Max Operating Temperature: 155°C; Military Standard: Not; Min Operating Temperature: -55°C; Mounting Technology: Surface Mount; Pins: 2; Number of Terminals: 2; Packaging: Tape & Reel; Power Rating: 100mW; REACH SVHC: Yes; Schedule B: 8533210045, 8533210045|8533210045|8533210045|8533210045|8533210045|8533210045|8533210045|8533210045|8533210045|8533210045|8533210045|8533210045|8533210045|8533210045|8533210045|8533210045|8533210045|8533210045|8533210045|8533210045|8533210045|8533210045|8533210045|85; Termination: SMD/SMT; Tolerance: 1%; Weight: 2.012816mg; Width: 800µm; Working Voltage: 75V; ComponentLink1URL: https://datasheet.octopart.com:443/RC0603FR-0710KL-Yageo-datasheet-175887523.pdf?src-supplier=IHS; ComponentLink1Description: https://datasheet.octopart.com:443/RC0603FR-0710KL-Yageo-datasheet-175887523.pdf?src-supplier=IHS; ComponentLink2URL: https://datasheet.octopart.com:443/RC0603FR-0710KL-Yageo-datasheet-103092701.pdf?src-supplier=Upverter; ComponentLink2Description: https://datasheet.octopart.com:443/RC0603FR-0710KL-Yageo-datasheet-103092701.pdf?src-supplier=Upverter; ComponentLink3URL: https://datasheet.octopart.com:443/RC0603FR-0710KL-Yageo-datasheet-98239111.pdf?src-supplier=Upverter; ComponentLink3Description: https://datasheet.octopart.com:443/RC0603FR-0710KL-Yageo-datasheet-98239111.pdf?src-supplier=Upverter; ComponentLink4URL: https://datasheet.octopart.com:443/RC0603FR-0710KL-Yageo-datasheet-141265859.pdf?src-supplier=Upverter; ComponentLink4Description: https://datasheet.octopart.com:443/RC0603FR-0710KL-Yageo-datasheet-141265859.pdf?src-supplier=Upverter; ComponentLink5URL: https://sigma.octopart.com:443/138820526/technical_drawing/Yageo-RC0603FR-0710KL.pdf?src-supplier=Upverter; ComponentLink5Description: https://sigma.octopart.com:443/138820526/technical_drawing/Yageo-RC0603FR-0710KL.pdf?src-supplier=Upverter; ComponentLink6URL: https://datasheet.octopart.com:443/RC0603FR-0710KL-Yageo-datasheet-8328172.pdf?src-supplier=Farnell; ComponentLink6Description: https://datasheet.octopart.com:443/RC0603FR-0710KL-Yageo-datasheet-8328172.pdf?src-supplier=Farnell; ComponentLink7URL: https://datasheet.octopart.com:443/RC0603FR-0710KL-Yageo-datasheet-13691069.pdf?src-supplier=Farnell; ComponentLink7Description: https://datasheet.octopart.com:443/RC0603FR-0710KL-Yageo-datasheet-13691069.pdf?src-supplier=Farnell; ComponentLink8URL: https://datasheet.octopart.com:443/RC0603FR-0710KL-Yageo-datasheet-62067350.pdf?src-supplier=element14+APAC; ComponentLink8Description: https://datasheet.octopart.com:443/RC0603FR-0710KL-Yageo-datasheet-62067350.pdf?src-supplier=element14+APAC; ComponentLink9URL: https://datasheet.octopart.com:443/RC0603FR-0710KL-Yageo-datasheet-17842380.pdf?src-supplier=element14+APAC; ComponentLink9Description: https://datasheet.octopart.com:443/RC0603FR-0710KL-Yageo-datasheet-17842380.pdf?src-supplier=element14+APAC; ComponentLink10URL: https://datasheet.octopart.com:443/RC0603FR-0710KL-Yageo-datasheet-15599030.pdf?src-supplier=Future+Electronics; ComponentLink10Description: https://datasheet.octopart.com:443/RC0603FR-0710KL-Yageo-datasheet-15599030.pdf?src-supplier=Future+Electronics; ComponentLink11URL: https://datasheet.octopart.com:443/RC0603FR-0710KL-Yageo-datasheet-164759695.pdf?src-supplier=Future+Electronics; ComponentLink11Description: https://datasheet.octopart.com:443/RC0603FR-0710KL-Yageo-datasheet-164759695.pdf?src-supplier=Future+Electronics; ComponentLink12URL: https://datasheet.octopart.com:443/RC0603FR-0710KL-Yageo-datasheet-127823281.pdf?src-supplier=Future+Electronics; ComponentLink12Description: https://datasheet.octopart.com:443/RC0603FR-0710KL-Yageo-datasheet-127823281.pdf?src-supplier=Future+Electronics; ComponentLink13URL: https://datasheet.octopart.com:443/RC0603FR-0710KL-Yageo-datasheet-137700087.pdf?src-supplier=Future+Electronics; ComponentLink13Description: https://datasheet.octopart.com:443/RC0603FR-0710KL-Yageo-datasheet-137700087.pdf?src-supplier=Future+Electronics; ComponentLink14URL: https://datasheet.octopart.com:443/RC0603FR-0710KL-Yageo-datasheet-27584510.pdf?src-supplier=Future+Electronics; ComponentLink14Description: https://datasheet.octopart.com:443/RC0603FR-0710KL-Yageo-datasheet-27584510.pdf?src-supplier=Future+Electronics; ComponentLink15URL: https://datasheet.octopart.com:443/RC0603FR-0710KL-Yageo-datasheet-8324193.pdf?src-supplier=Future+Electronics; ComponentLink15Description: https://datasheet.octopart.com:443/RC0603FR-0710KL-Yageo-datasheet-8324193.pdf?src-supplier=Future+Electronics; ComponentLink16URL: https://datasheet.octopart.com:443/RC0603FR-0710KL-Yageo-datasheet-12596169.pdf?src-supplier=Newark; ComponentLink16Description: https://datasheet.octopart.com:443/RC0603FR-0710KL-Yageo-datasheet-12596169.pdf?src-supplier=Newark; ComponentLink17URL: https://datasheet.octopart.com:443/RC0603FR-0710KL-Yageo-datasheet-503470.pdf?src-supplier=Newark; ComponentLink17Description: https://datasheet.octopart.com:443/RC0603FR-0710KL-Yageo-datasheet-503470.pdf?src-supplier=Newark; ComponentLink18URL: https://datasheet.octopart.com:443/RC0603FR-0710KL-Yageo-datasheet-34211833.pdf?src-supplier=Newark; ComponentLink18Description: https://datasheet.octopart.com:443/RC0603FR-0710KL-Yageo-datasheet-34211833.pdf?src-supplier=Newark; ComponentLink19URL: https://datasheet.octopart.com:443/RC0603FR-0710KL-Yageo-datasheet-79472498.pdf?src-supplier=Megastar; ComponentLink19Description: https://datasheet.octopart.com:443/RC0603FR-0710KL-Yageo-datasheet-79472498.pdf?src-supplier=Megastar; ComponentLink20URL: https://datasheet.octopart.com/RC0603FR-0710KL-Yageo-datasheet-73766026.pdf; ComponentLink20Description: https://datasheet.octopart.com/RC0603FR-0710KL-Yageo-datasheet-73766026.pdf; ComponentLink21URL: https://datasheet.octopart.com:443/RC0603FR-0710KL-Yageo-datasheet-118562.pdf?src-supplier=DigiKey; ComponentLink21Description: https://datasheet.octopart.com:443/RC0603FR-0710KL-Yageo-datasheet-118562.pdf?src-supplier=DigiKey; ComponentLink22URL: http://sigma.octopart.com:80/rohs_statement/Yageo-company-2.pdf?src-supplier=Compliance+Statements; ComponentLink22Description: http://sigma.octopart.com:80/rohs_statement/Yageo-company-2.pdf?src-supplier=Compliance+Statements; ComponentLink23URL: http://sigma.octopart.com:80/conflict_mineral_statement/Yageo-company-3.pdf?src-supplier=Compliance+Statements; ComponentLink23Description: http://sigma.octopart.com:80/conflict_mineral_statement/Yageo-company-3.pdf?src-supplier=Compliance+Statements; LCSC PN: C98220
U2 = TRF7970ARHBR: RFID Reader/Transponder IC 13.56MHz ISO 14443, ISO 15693, ISO 18000-3 SPI 2.7V ~ 5.5V 32-VFQFN Exposed Pad; Manufacturer: Texas Instruments; Manufacturer Lifecycle Status: ACTIVE; Data Rate: 848kbps; Interface: Parallel, SPI; Logic Function: AND; Clock Frequency: 10MHz; Max Junction Temperature (Tj): 125°C; Max Supply Current: 150mA; Memory Size: 127B; Number of Receivers: 2; Number of Transmitters: 1; Output Power: 200mW; Supplier: DigiKey; Manufacturer Part Number: TRF7970ARHBR; RoHS: Compliant; Category: NFC / RFID Components; Stock: 6004; Pricing: 1=5.34, 10=4.619, 25=4.3692, 100=4.0263, 250=3.82068, 500=3.67548, 1000=3.53871 (USD); Ambient Temperature Range High: 110°C; Case/Package: VQFN; Frequency: 13.56MHz; Height: 1mm; Lead Free: Lead Free; Length: 5mm; Lifecycle Status: Production; Max Operating Temperature: 110°C; Max Supply Voltage: 5.5V; Min Operating Temperature: -40°C; Min Supply Voltage: 2.7V; Mounting Technology: Surface Mount; Nominal Supply Current: 150mA; Pins: 32; Radiation Hardening: No; REACH SVHC: No; Schedule B: 8542390000, 8542390000|8542390000|8542390000|8542390000|8542390000|8542390000|8542390000|8542390000|8542390000|8542390000|8542390000|8542390000|8542390000|8542390000|8542390000|8542390000|8542390000|8542390000|8542390000|8542390000|8542390000|8542390000|8542390000|85; Thickness: 900µm; Type: Integrated Circuit (IC); Width: 5mm; ComponentLink1URL: https://sigma.octopart.com:443/62329895/technical_drawing/Texas-Instruments-TRF7970ARHBR.pdf?src-supplier=Texas+Instruments; ComponentLink1Description: https://sigma.octopart.com:443/62329895/technical_drawing/Texas-Instruments-TRF7970ARHBR.pdf?src-supplier=Texas+Instruments; ComponentLink2URL: https://octopart.com:443/opatz8j6/c1?t=IghbH9K5BSlkrmafdcRJOjOMiUtgER9_UsQYrHEJ6Vfo6Ioxq16LS6aIzyGCRnLvR9m9OBdPS8kwxfs_RCrwULCztlh_i_mrPqhWE-TKv1p1aFKq-a2T-72gKO8i_n92hmrRnFkuxQ6HqGicZvxZjjjInAwCXPw4t04numvYX1F5w6kKi9bTGPUaBVhJgBpiU6kFUz70XEg59TYW5G4lOmMRb6wPwkqmd0V4FfF6mxucMr8rde4kmAl5iv6vdj6zdgQV5BxJ1V84Wye9ek93ut4UBWezHG_egO_F_atnXHjzArlpiK84uSKLM4sZH2A012EttCbFqka2tdgwGGQhJEXuNUjqQbVs-zwZEEdtNsXtoskYaNvwxQknjklaDd_gE4gdLcwT&src-supplier=Texas+Instruments; ComponentLink2Description: https://octopart.com:443/opatz8j6/c1?t=IghbH9K5BSlkrmafdcRJOjOMiUtgER9_UsQYrHEJ6Vfo6Ioxq16LS6aIzyGCRnLvR9m9OBdPS8kwxfs_RCrwULCztlh_i_mrPqhWE-TKv1p1aFKq-a2T-72gKO8i_n92hmrRnFkuxQ6HqGicZvxZjjjInAwCXPw4t04numvYX1F5w6kKi9bTGPUaBVhJgBpiU6kFUz70XEg59TYW5G4lOmMRb6wPwkqmd0V4FfF6mxucMr8rde4kmAl5iv6vdj6zdgQV5BxJ1V84Wye9ek93ut4UBWezHG_egO_F_atnXHjzArlpiK84uSKLM4sZH2A012EttCbFqka2tdgwGGQhJEXuNUjqQbVs-zwZEEdtNsXtoskYaNvwxQknjklaDd_gE4gdLcwT&src-supplier=Texas+Instruments; ComponentLink3URL: https://datasheet.octopart.com:443/TRF7970ARHBR-Texas-Instruments-datasheet-13293049.pdf?src-supplier=Texas+Instruments; ComponentLink3Description: https://datasheet.octopart.com:443/TRF7970ARHBR-Texas-Instruments-datasheet-13293049.pdf?src-supplier=Texas+Instruments; ComponentLink4URL: https://datasheet.octopart.com:443/TRF7970ARHBR-Texas-Instruments-datasheet-12985920.pdf?src-supplier=Texas+Instruments; ComponentLink4Description: https://datasheet.octopart.com:443/TRF7970ARHBR-Texas-Instruments-datasheet-12985920.pdf?src-supplier=Texas+Instruments; ComponentLink5URL: https://datasheet.octopart.com:443/TRF7970ARHBR-Texas-Instruments-datasheet-11516041.pdf?src-supplier=Texas+Instruments; ComponentLink5Description: https://datasheet.octopart.com:443/TRF7970ARHBR-Texas-Instruments-datasheet-11516041.pdf?src-supplier=Texas+Instruments; ComponentLink6URL: https://datasheet.octopart.com:443/TRF7970ARHBR-Texas-Instruments-datasheet-10888147.pdf?src-supplier=Texas+Instruments; ComponentLink6Description: https://datasheet.octopart.com:443/TRF7970ARHBR-Texas-Instruments-datasheet-10888147.pdf?src-supplier=Texas+Instruments; ComponentLink7URL: https://sigma.octopart.com:443/49249790/technical_drawing/Texas-Instruments-TRF7970ARHBR.pdf?src-supplier=Texas+Instruments; ComponentLink7Description: https://sigma.octopart.com:443/49249790/technical_drawing/Texas-Instruments-TRF7970ARHBR.pdf?src-supplier=Texas+Instruments; ComponentLink8URL: https://datasheet.octopart.com:443/TRF7970ARHBR-Texas-Instruments-datasheet-15828043.pdf?src-supplier=Newark; ComponentLink8Description: https://datasheet.octopart.com:443/TRF7970ARHBR-Texas-Instruments-datasheet-15828043.pdf?src-supplier=Newark; ComponentLink9URL: https://datasheet.octopart.com:443/TRF7970ARHBR-Texas-Instruments-datasheet-85392281.pdf?src-supplier=Newark; ComponentLink9Description: https://datasheet.octopart.com:443/TRF7970ARHBR-Texas-Instruments-datasheet-85392281.pdf?src-supplier=Newark; ComponentLink10URL: https://datasheet.octopart.com:443/TRF7970ARHBR-Texas-Instruments-datasheet-57571215.pdf?src-supplier=Newark; ComponentLink10Description: https://datasheet.octopart.com:443/TRF7970ARHBR-Texas-Instruments-datasheet-57571215.pdf?src-supplier=Newark; ComponentLink11URL: https://datasheet.octopart.com:443/TRF7970ARHBR-Texas-Instruments-datasheet-38329872.pdf?src-supplier=Newark; ComponentLink11Description: https://datasheet.octopart.com:443/TRF7970ARHBR-Texas-Instruments-datasheet-38329872.pdf?src-supplier=Newark; ComponentLink12URL: https://datasheet.octopart.com:443/TRF7970ARHBR-Texas-Instruments-datasheet-10670366.pdf?src-supplier=Upverter; ComponentLink12Description: https://datasheet.octopart.com:443/TRF7970ARHBR-Texas-Instruments-datasheet-10670366.pdf?src-supplier=Upverter; ComponentLink13URL: https://datasheet.octopart.com:443/TRF7970ARHBR-Texas-Instruments-datasheet-164420946.pdf?src-supplier=Augswan; ComponentLink13Description: https://datasheet.octopart.com:443/TRF7970ARHBR-Texas-Instruments-datasheet-164420946.pdf?src-supplier=Augswan; ComponentLink14URL: https://datasheet.octopart.com:443/TRF7970ARHBR-Texas-Instruments-datasheet-164296437.pdf?src-supplier=LCSC; ComponentLink14Description: https://datasheet.octopart.com:443/TRF7970ARHBR-Texas-Instruments-datasheet-164296437.pdf?src-supplier=LCSC; ComponentLink15URL: https://datasheet.octopart.com:443/TRF7970ARHBR-Texas-Instruments-datasheet-140572024.pdf?src-supplier=Arrow.cn; ComponentLink15Description: https://datasheet.octopart.com:443/TRF7970ARHBR-Texas-Instruments-datasheet-140572024.pdf?src-supplier=Arrow.cn; ComponentLink16URL: http://sigma.octopart.com:80/reach_statement/Texas-Instruments-company-64.pdf?src-supplier=Compliance+Statements; ComponentLink16Description: http://sigma.octopart.com:80/reach_statement/Texas-Instruments-company-64.pdf?src-supplier=Compliance+Statements; ComponentLink17URL: http://sigma.octopart.com:80/conflict_mineral_statement/Texas-Instruments-company-63.pdf?src-supplier=Compliance+Statements; ComponentLink17Description: http://sigma.octopart.com:80/conflict_mineral_statement/Texas-Instruments-company-63.pdf?src-supplier=Compliance+Statements; LCSC PN: C117004
Y1 = QT532G-13.560MAHJ-T: 13.56 MHz ±30ppm Crystal 18pF 50 Ohms 2-SMD, No Lead; Manufacturer: QST; Supplier: DigiKey; Manufacturer Part Number: QT532G-13.560MAHJ-T; Category: Crystals; Stock: 800; Pricing: 1=0.56, 10=0.491, 25=0.4644, 50=0.445, 100=0.4266, 250=0.40344, 500=0.38674, 1000=0.37073, 2000=0.3554, 3000=0.34672, 5000=0.3361, 7000=0.32929, 10000=0.32222, 12000=0.31866, 24000=0.30551, 25000=0.30475 (USD); ComponentLink1URL: https://datasheet.octopart.com:443/QT532G-13.560MAHJ-T-QST-datasheet-188916294.pdf?src-supplier=TME; ComponentLink1Description: https://datasheet.octopart.com:443/QT532G-13.560MAHJ-T-QST-datasheet-188916294.pdf?src-supplier=TME; LCSC PN: C6633022